# EAGLE design battery_powered_devel_board (EAGLE 6.5.0)
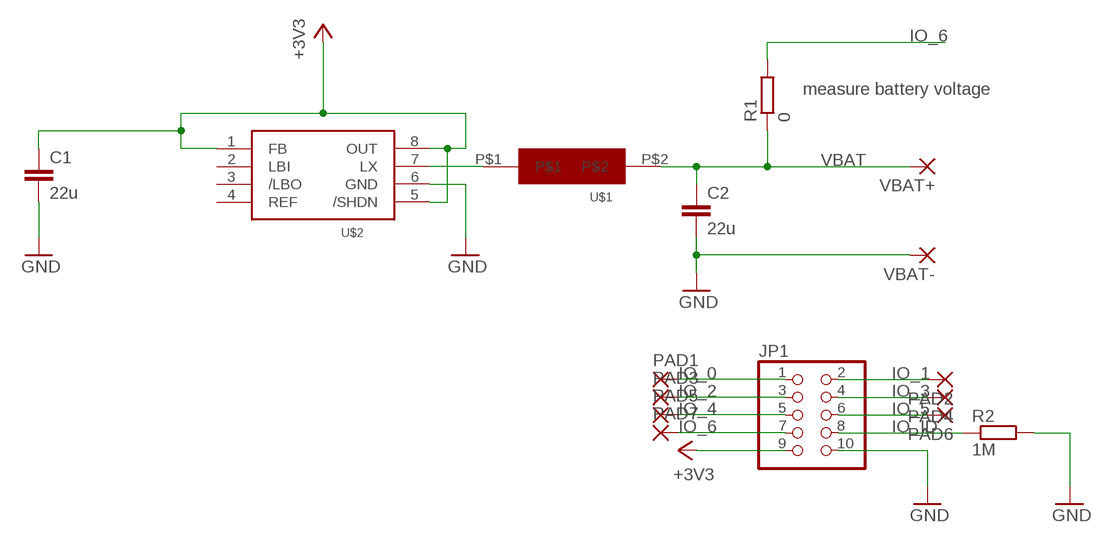
[diagram p0: schematic, sheet 1]

## Parts
C1  22u  C-EUC0805  [C0805]
C2  22u  C-EUC0805  [C0805]
JP1  PINHD-2X5  [2X05]
PAD1  1,6/0,8  [1,6/0,8]
PAD2  1,6/0,8  [1,6/0,8]
PAD3  1,6/0,8  [1,6/0,8]
PAD4  1,6/0,8  [1,6/0,8]
PAD5  1,6/0,8  [1,6/0,8]
PAD6  1,6/0,8  [1,6/0,8]
PAD7  1,6/0,8  [1,6/0,8]
R1  0  R-EU_R0402  [R0402]
R2  1M  R-EU_R0402  [R0402]
U$1  ELL_INDUCTOR  [ELL6_INDUCTOR]
U$2  L6920  [TSSOP8]
VBAT+  2,54/1,0  [2,54/1,0]
VBAT-  2,54/1,0  [2,54/1,0]

## Nets
+3V3: C1.1 JP1.9 U$2.1(FB) U$2.5(/SHDN) U$2.8(OUT)
GND: C1.2 C2.2 JP1.10 R2.2 U$2.6(GND) VBAT-.1(P)
IO_0: JP1.1 PAD1.1(P)
IO_1: JP1.2 PAD2.1(P)
IO_2: JP1.3 PAD3.1(P)
IO_3: JP1.4 PAD4.1(P)
IO_4: JP1.5 PAD5.1(P)
IO_5: JP1.6 PAD6.1(P)
IO_6: JP1.7 PAD7.1(P) R1.2
IO_ID: JP1.8 R2.1
N$2: U$1.P$1 U$2.7(LX)
VBAT: C2.1 R1.1 U$1.P$2 VBAT+.1(P)
Unconnected: U$2.2(LBI) U$2.3(/LBO) U$2.4(REF)

## Notes on the sheet
- measure battery voltage

## Library data of the parts
C1 C2 = rcl:C-EU: CAPACITOR, European symbol; DIGIKEY: 1276-1100-1-ND
JP1 = pinhead:PINHD-2X5: PIN HEADER; DIGIKEY: S6105-ND
PAD1-PAD7 = wirepad:1,6/0,8: THROUGH-HOLE PAD
R1 = rcl:R-EU_: RESISTOR, European symbol; DIGIKEY: 311-0.0JRCT-ND
R2 = rcl:R-EU_: RESISTOR, European symbol; DIGIKEY: 311-1.00MLRCT-ND
U$1 = ell_inductor:ELL_INDUCTOR; DIGIKEY: PCD1345CT-ND
U$2 = l6920_step_up:L6920; DIGIKEY: L6920D-ND
VBAT+ VBAT- = wirepad:2,54/1,0: THROUGH-HOLE PAD

## Board
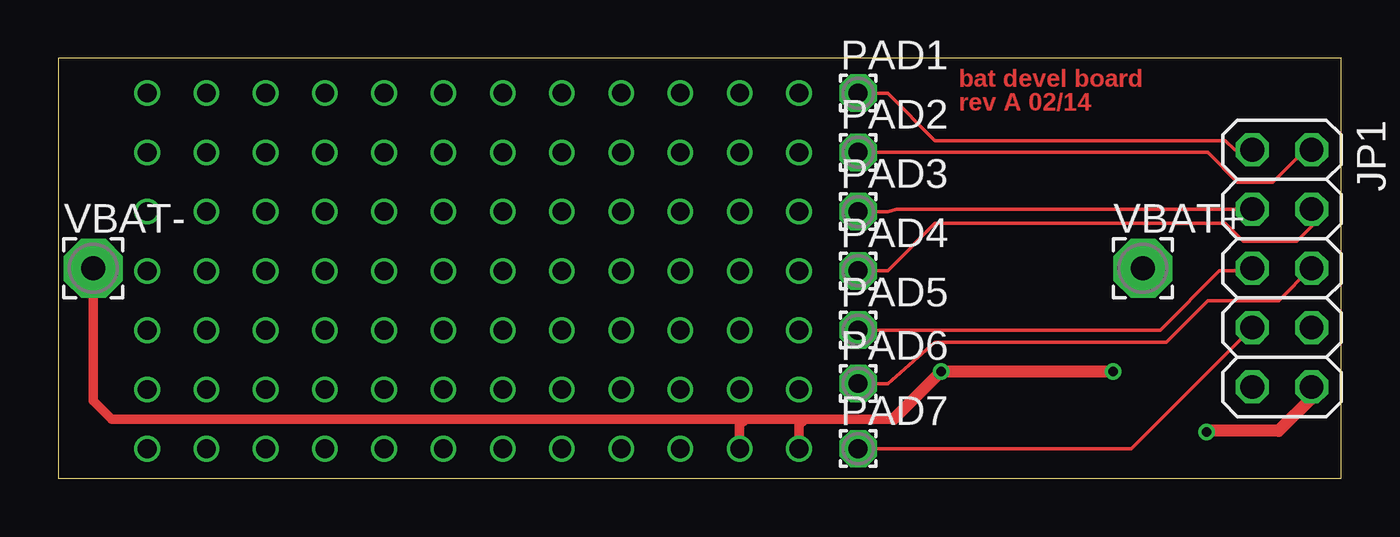
[diagram p1: board, top side]
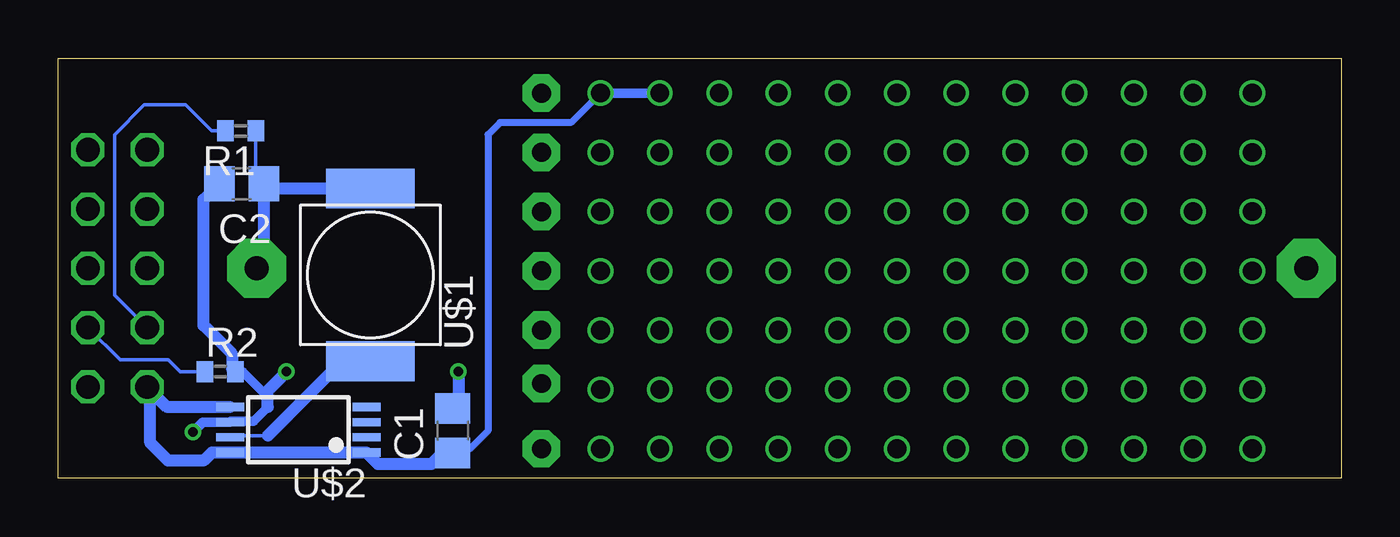
[diagram p2: board, bottom side, seen from below]

Size 55 x 18 mm. Coordinates in mm from the lower left corner, seen from the top.
Outline: 0,0 55,0 55,18 0,18 0,0
Copper layers (1*16): Top 0.035mm / dielectric 1.5mm / Bottom 0.035mm
Design rules "PCB-POOL Standard": minimum track width 0.15mm, minimum drill 0.3mm, track to track 0.15mm, track to pad 0.15mm, pad to pad 0.15mm, via to via 0.15mm, smd to smd 0.15mm, copper to edge 0.3mm, drill to drill 0.2mm, minimum pad ring 0.2mm, minimum via ring 0.15mm, stop-mask expansion 0.075mm, vias tented up to drill 0mil, thermal gap 0.2mm

### Footprints (pad centres in the part's own frame; a part is rotated, then mirrored left to right if it is on the bottom)
C0805 = smd 1.3 x 1.5: 1 -0.95,0; 2 0.95,0
2X05 = drill 1.016 octagon: 1 -5.08,-1.27; 2 -5.08,1.27; 3 -2.54,-1.27; 4 -2.54,1.27; 5 0,-1.27; 6 0,1.27; 7 2.54,-1.27; 8 2.54,1.27; 9 5.08,-1.27; 10 5.08,1.27
1,6/0,8 = drill 0.813 pad 1.6 octagon: 1 0,0
R0402 = smd 0.7 x 0.9: 1 -0.65,0; 2 0.65,0
ELL6_INDUCTOR = smd 1.7 x 3.8: P$1 -3.7,0; P$2 3.7,0
TSSOP8 = smd 1.2 x 0.35: 1 -2.925,0.975; 2 -2.925,0.325; 3 -2.925,-0.325; 4 -2.925,-0.975; 5 2.925,-0.975; 6 2.925,-0.325; 7 2.925,0.325; 8 2.925,0.975
2,54/1,0 = drill 1.016 pad 2.54 octagon: 1 0,0

### Placement (x,y rotation side)
C1  38.09,2.04 90 bottom
C2  47.14,12.62 180 bottom
JP1  52.46,9 270 top
PAD1  34.29,16.51 0 top
PAD2  34.29,13.97 0 top
PAD3  34.29,11.43 0 top
PAD4  34.29,8.89 0 top
PAD5  34.29,6.35 0 top
PAD6  34.29,4.06 0 top
PAD7  34.29,1.27 0 top
R1  47.18,14.89 180 bottom
R2  48.06,4.57 0 bottom
U$1  41.62,8.72 90 bottom
U$2  44.71,2.08 180 bottom
VBAT+  46.5,9 0 top
VBAT-  1.5,9 0 top

### Tracks (layer width: path | path; a pad name or v marks a point on that pad's centre or on a via)
+3V3  (via drill 0.8)
  Bottom 0.305: v31.75,16.51 33.02,15.24 36.07,15.24 36.58,14.73 36.58,2.03 37.34,1.27 37.91,1.27 C1.1
  Bottom 0.406: v31.75,16.51 v29.21,16.51
  Bottom 0.508: C1.1 38.53,1.09 39.01,0.61 41.29,0.61 U$2.1 U$2.8 48.42,1.1 48.77,0.76 50.29,0.76 51.05,1.52 51.05,3.78 JP1.9 50.33,3.06 U$2.5
GND  (via drill 0.41, 0.8)
  Top 0.406: VBAT-.1 1.5,3.33 2.29,2.54 29.46,2.54 | 29.46,2.54 32,2.54 | 32,2.54 35.81,2.54 | v31.75,1.27 31.75,2.29 32,2.54 | v29.21,1.27 29.21,2.29 29.46,2.54
  Top 0.508: 35.81,2.54 v37.85,4.57 v45.21,4.57 | JP1.10 53.73,3.44 52.32,2.03 49.28,2.03 v49.23,1.98
  Bottom 0.406: v49.23,1.98 48.8,2.4 U$2.6 47.6,2.44 46.63,2.44 46.02,3.05 46.02,3.5 47.09,4.57 R2.2
  Bottom 0.508: R2.2 47.55,4.71 47.55,5.33 48.77,6.55 48.77,11.94 C2.2 | v37.85,4.57 37.85,3.26 C1.2 | 46.02,3.05 46.02,3.76 v45.21,4.57
IO_0
  Top 0.152: JP1.1 50.44,14.08 50.04,14.48 37.59,14.48 35.56,16.51 PAD1.1
IO_1
  Top 0.152: JP1.2 53.45,14.08 52.07,12.7 50.55,12.7 49.28,13.97 PAD2.1
IO_2
  Top 0.152: JP1.3 35.92,11.54 35.56,11.43 PAD3.1
IO_3
  Top 0.152: JP1.4 53.73,10.8 53.09,10.16 50.8,10.16 50.04,10.92 37.59,10.92 35.56,8.89 PAD4.1
IO_4
  Top 0.152: PAD5.1 47.24,6.35 49.78,8.89 51.08,8.89 JP1.5
IO_5
  Top 0.152: JP1.6 53.7,9 52.32,7.62 49.28,7.62 47.5,5.84 37.59,5.84 35.56,4.06 PAD6.1
IO_6
  Top 0.152: PAD7.1 46,1.27 JP1.7
  Bottom 0.152: R1.2 48.42,14.89 49.53,16 51.31,16 52.58,14.73 52.58,7.85 JP1.7
IO_ID
  Bottom 0.152: R2.1 49.78,4.57 50.29,5.08 52.35,5.08 JP1.8
N$2
  Bottom 0.152: 46.02,1.83 47.56,1.83 U$2.7
  Bottom 0.508: U$1.P$1 42.83,5.02 46.02,1.83
N$5  (via drill 0.8)
  other vias: 26.67,16.51
N$6  (via drill 0.8)
  other vias: 24.13,16.51
N$7  (via drill 0.8)
  other vias: 21.59,16.51
N$8  (via drill 0.8)
  other vias: 19.05,16.51
N$9  (via drill 0.8)
  other vias: 16.51,16.51
N$10  (via drill 0.8)
  other vias: 13.97,16.51
N$11  (via drill 0.8)
  other vias: 11.43,16.51
N$12  (via drill 0.8)
  other vias: 8.89,16.51
N$13  (via drill 0.8)
  other vias: 6.35,16.51
N$14  (via drill 0.8)
  other vias: 3.81,16.51
N$15  (via drill 0.8)
  other vias: 31.75,13.97
N$16  (via drill 0.8)
  other vias: 29.21,13.97
N$17  (via drill 0.8)
  other vias: 26.67,13.97
N$18  (via drill 0.8)
  other vias: 24.13,13.97
N$19  (via drill 0.8)
  other vias: 21.59,13.97
N$20  (via drill 0.8)
  other vias: 19.05,13.97
N$21  (via drill 0.8)
  other vias: 16.51,13.97
N$22  (via drill 0.8)
  other vias: 13.97,13.97
N$23  (via drill 0.8)
  other vias: 11.43,13.97
N$24  (via drill 0.8)
  other vias: 8.89,13.97
N$25  (via drill 0.8)
  other vias: 6.35,13.97
N$26  (via drill 0.8)
  other vias: 3.81,13.97
N$27  (via drill 0.8)
  other vias: 31.75,11.43
N$28  (via drill 0.8)
  other vias: 29.21,11.43
N$29  (via drill 0.8)
  other vias: 26.67,11.43
N$30  (via drill 0.8)
  other vias: 24.13,11.43
N$31  (via drill 0.8)
  other vias: 21.59,11.43
N$32  (via drill 0.8)
  other vias: 19.05,11.43
N$33  (via drill 0.8)
  other vias: 16.51,11.43
N$34  (via drill 0.8)
  other vias: 13.97,11.43
N$35  (via drill 0.8)
  other vias: 11.43,11.43
N$36  (via drill 0.8)
  other vias: 8.89,11.43
N$37  (via drill 0.8)
  other vias: 6.35,11.43
N$38  (via drill 0.8)
  other vias: 3.81,11.43
N$39  (via drill 0.8)
  other vias: 31.75,8.89
N$40  (via drill 0.8)
  other vias: 29.21,8.89
N$41  (via drill 0.8)
  other vias: 26.67,8.89
N$42  (via drill 0.8)
  other vias: 24.13,8.89
N$43  (via drill 0.8)
  other vias: 21.59,8.89
N$44  (via drill 0.8)
  other vias: 19.05,8.89
N$45  (via drill 0.8)
  other vias: 16.51,8.89
N$46  (via drill 0.8)
  other vias: 13.97,8.89
N$47  (via drill 0.8)
  other vias: 11.43,8.89
N$48  (via drill 0.8)
  other vias: 8.89,8.89
N$49  (via drill 0.8)
  other vias: 6.35,8.89
N$50  (via drill 0.8)
  other vias: 3.81,8.89
N$51  (via drill 0.8)
  other vias: 31.75,6.35
N$52  (via drill 0.8)
  other vias: 29.21,6.35
N$53  (via drill 0.8)
  other vias: 26.67,6.35
N$54  (via drill 0.8)
  other vias: 24.13,6.35
N$55  (via drill 0.8)
  other vias: 21.59,6.35
N$56  (via drill 0.8)
  other vias: 19.05,6.35
N$57  (via drill 0.8)
  other vias: 16.51,6.35
N$58  (via drill 0.8)
  other vias: 13.97,6.35
N$59  (via drill 0.8)
  other vias: 11.43,6.35
N$60  (via drill 0.8)
  other vias: 8.89,6.35
N$61  (via drill 0.8)
  other vias: 6.35,6.35
N$62  (via drill 0.8)
  other vias: 3.81,6.35
N$63  (via drill 0.8)
  other vias: 3.81,3.81
N$64  (via drill 0.8)
  other vias: 6.35,3.81
N$65  (via drill 0.8)
  other vias: 8.89,3.81
N$66  (via drill 0.8)
  other vias: 11.43,3.81
N$67  (via drill 0.8)
  other vias: 13.97,3.81
N$68  (via drill 0.8)
  other vias: 16.51,3.81
N$69  (via drill 0.8)
  other vias: 19.05,3.81
N$70  (via drill 0.8)
  other vias: 21.59,3.81
N$71  (via drill 0.8)
  other vias: 24.13,3.81
N$72  (via drill 0.8)
  other vias: 26.67,3.81
N$73  (via drill 0.8)
  other vias: 29.21,3.81
N$74  (via drill 0.8)
  other vias: 31.75,3.81
N$77  (via drill 0.8)
  other vias: 26.67,1.27
N$78  (via drill 0.8)
  other vias: 24.13,1.27
N$79  (via drill 0.8)
  other vias: 21.59,1.27
N$80  (via drill 0.8)
  other vias: 19.05,1.27
N$81  (via drill 0.8)
  other vias: 16.51,1.27
N$82  (via drill 0.8)
  other vias: 13.97,1.27
N$83  (via drill 0.8)
  other vias: 11.43,1.27
N$84  (via drill 0.8)
  other vias: 8.89,1.27
N$85  (via drill 0.8)
  other vias: 6.35,1.27
N$86  (via drill 0.8)
  other vias: 3.81,1.27
VBAT
  Bottom 0.152: R1.1 46.53,12.96 C2.1
  Bottom 0.508: U$1.P$2 45.99,12.42 C2.1 46.19,9.31 VBAT+.1

### Text on the board
Top: bat devel board | rev A 02/14
tDocu: Battery sits on top | FEMALE / BOTTOM